# Altium schematic sheet Main.SchDoc
size A4
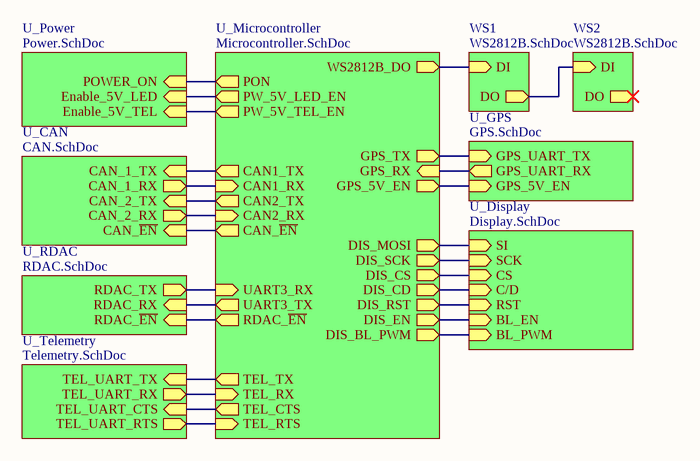
[diagram p0: Main.SchDoc]

## Sub-sheets
U_CAN = CAN.SchDoc: CAN_1_TX (in), CAN_1_RX (out), CAN_2_RX (out), CAN_2_TX (in), CAN_~{EN} (in)
U_Display = Display.SchDoc: SI (in), SCK (in), RST (in), CS (in), C/D (in), BL_EN (in), BL_PWM (in)
U_GPS = GPS.SchDoc: GPS_UART_TX (in), GPS_UART_RX (out), GPS_5V_EN (in)
U_Microcontroller = Microcontroller.SchDoc: WS2812B_DO (out), GPS_TX (out), GPS_RX (in), TEL_TX (out), TEL_RX (in), TEL_CTS (out), TEL_RTS (in), CAN2_RX (in), CAN2_TX (out), CAN1_RX (in), CAN1_TX (out), DIS_CS (out), DIS_SCK (out), DIS_CD (out), DIS_MOSI (out), CAN_~{EN} (out), UART3_TX (out), UART3_RX (in), RDAC_~{EN} (out), GPS_5V_EN (out), DIS_EN (out), DIS_RST (out), PW_5V_TEL_EN (out), PW_5V_LED_EN (out), PON (out), DIS_BL_PWM (out)
U_Power = Power.SchDoc: Enable_5V_LED (in), Enable_5V_TEL (in), POWER_ON (in)
U_RDAC = RDAC.SchDoc: RDAC_TX (out), RDAC_RX (in), RDAC_~{EN} (in)
U_Telemetry = Telemetry.SchDoc: TEL_UART_TX (in), TEL_UART_RX (out), TEL_UART_CTS (in), TEL_UART_RTS (out)
WS1 = WS2812B.SchDoc: DI (in), DO (out)
WS2 = WS2812B.SchDoc: DI (in), DO (out)

## Nets
(unnamed): sheet WS1/DI, sheet U_Microcontroller/WS2812B_DO
(unnamed): sheet WS1/DO, sheet WS2/DI
(unnamed): sheet U_Display/SI, sheet U_Microcontroller/DIS_MOSI
(unnamed): sheet U_Display/SCK, sheet U_Microcontroller/DIS_SCK
(unnamed): sheet U_Display/RST, sheet U_Microcontroller/DIS_RST
(unnamed): sheet U_Display/CS, sheet U_Microcontroller/DIS_CS
(unnamed): sheet U_Display/C/D, sheet U_Microcontroller/DIS_CD
(unnamed): sheet U_Display/BL_EN, sheet U_Microcontroller/DIS_EN
(unnamed): sheet U_Display/BL_PWM, sheet U_Microcontroller/DIS_BL_PWM
(unnamed): sheet U_Microcontroller/GPS_TX, sheet U_GPS/GPS_UART_TX
(unnamed): sheet U_Microcontroller/GPS_RX, sheet U_GPS/GPS_UART_RX
(unnamed): sheet U_Microcontroller/TEL_TX, sheet U_Telemetry/TEL_UART_TX
(unnamed): sheet U_Microcontroller/TEL_RX, sheet U_Telemetry/TEL_UART_RX
(unnamed): sheet U_Microcontroller/TEL_CTS, sheet U_Telemetry/TEL_UART_CTS
(unnamed): sheet U_Microcontroller/TEL_RTS, sheet U_Telemetry/TEL_UART_RTS
(unnamed): sheet U_Microcontroller/CAN2_RX, sheet U_CAN/CAN_2_RX
(unnamed): sheet U_Microcontroller/CAN2_TX, sheet U_CAN/CAN_2_TX
(unnamed): sheet U_Microcontroller/CAN1_RX, sheet U_CAN/CAN_1_RX
(unnamed): sheet U_Microcontroller/CAN1_TX, sheet U_CAN/CAN_1_TX
(unnamed): sheet U_Microcontroller/CAN_~{EN}, sheet U_CAN/CAN_~{EN}
(unnamed): sheet U_Microcontroller/UART3_TX, sheet U_RDAC/RDAC_RX
(unnamed): sheet U_Microcontroller/UART3_RX, sheet U_RDAC/RDAC_TX
(unnamed): sheet U_Microcontroller/RDAC_~{EN}, sheet U_RDAC/RDAC_~{EN}
(unnamed): sheet U_Microcontroller/GPS_5V_EN, sheet U_GPS/GPS_5V_EN
(unnamed): sheet U_Microcontroller/PW_5V_TEL_EN, sheet U_Power/Enable_5V_TEL
(unnamed): sheet U_Microcontroller/PW_5V_LED_EN, sheet U_Power/Enable_5V_LED
(unnamed): sheet U_Microcontroller/PON, sheet U_Power/POWER_ON